# Altium schematic sheet MCU.SchDoc
size B
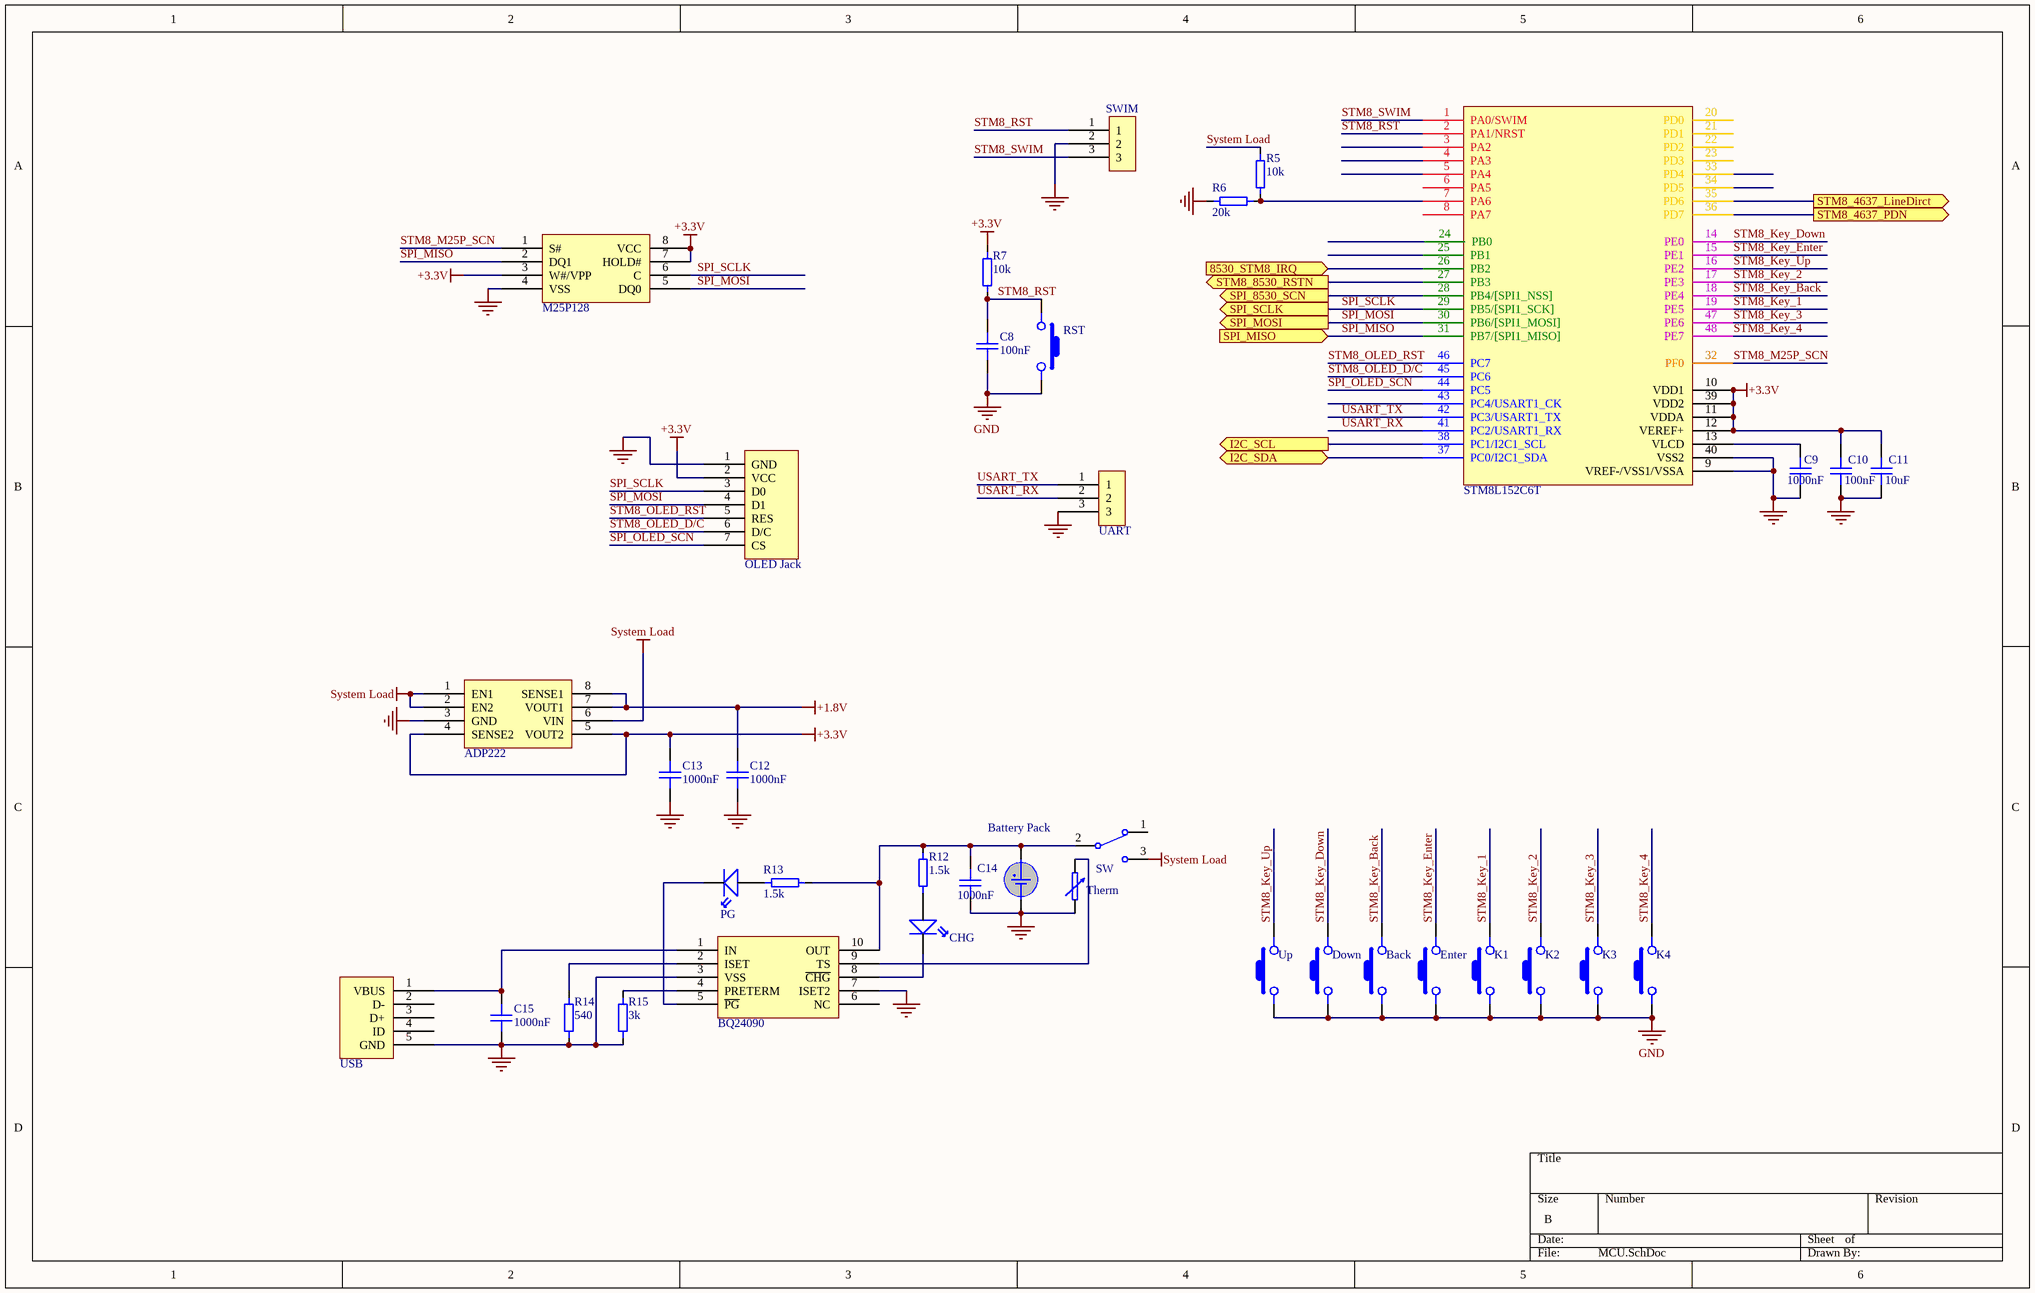
[diagram p0: MCU.SchDoc]

## Parts
ADP222  ADP222ACPZ-1833-R7  [ADP22x]  (value not drawn)
Back  Button  [Button_3x4]  (value not drawn)
Battery_Pack  Battery Pack  [Battery Jack small]  (value not drawn)
BQ24090  BQ24090  [BQ24090]  (value not drawn)
C8  value 100nF  [SMD 0402]  (hidden comment: Capacity SMD)
C9  value 1000nF  [SMD 0402]  (hidden comment: Capacity SMD)
C10  value 100nF  [SMD 0402]  (hidden comment: Capacity SMD)
C11  value 10uF  [SMD 0402]  (hidden comment: Capacity SMD)
C12  value 1000nF  [SMD 0402]  (hidden comment: Capacity SMD)
C13  value 1000nF  [SMD 0402]  (hidden comment: Capacity SMD)
C14  value 1000nF  [SMD 0402]  (hidden comment: Capacity SMD)
C15  value 1000nF  [SMD 0402_silk]  (hidden comment: Capacity SMD)
CHG  LED  [LED_0603]  (value not drawn)
Down  Button  [Button_3x4]  (value not drawn)
Enter  Button  [Button_3x4]  (value not drawn)
K1  Button  [Button_3x4]  (value not drawn)
K2  Button  [Button_3x4]  (value not drawn)
K3  Button  [Button_3x4]  (value not drawn)
K4  Button  [Button_3x4]  (value not drawn)
M25P128  M25P128  [M25P128]  (value not drawn)
OLED_Jack  OLED Jack  [OLED Jack]  (value not drawn)
PG  LED  [LED_0603]  (value not drawn)
R5  value 10k  [SMD 0402]  (hidden comment: Resistor SMD)
R6  value 20k  [SMD 0402]  (hidden comment: Resistor SMD)
R7  value 10k  [SMD 0402]  (hidden comment: Resistor SMD)
R12  value 1.5k  [SMD 0402]  (hidden comment: Resistor SMD)
R13  value 1.5k  [SMD 0402]  (hidden comment: Resistor SMD)
R14  value 540  [SMD 0402]  (hidden comment: Resistor SMD)
R15  value 3k  [SMD 0402]  (hidden comment: Resistor SMD)
RST  Button  [Button_3x4]  (value not drawn)
STM8L152C6T  STM8L152C6T  [STM LQFP48]  (value not drawn)
SW  Switch  [Switch 2P2T]  (value not drawn)
SWIM  Header_3x1  [HEADER_3x1_2.54]  (value not drawn)
Therm  Thermistor  [Header_2x1_2.00]  (value not drawn)
UART  Header_3x1  [HEADER_3x1_2.54]  (value not drawn)
Up  Button  [Button_3x4]  (value not drawn)
USB  USB Jack Mirco-B  [USB Micro-B]  (value not drawn)

## Ports
8530_STM8_IRQ (in), I2C_SCL (out), I2C_SDA (bidir), SPI_8530_SCN (out), SPI_MISO (in), SPI_MOSI (out), SPI_SCLK (out), STM8_4637_LineDirct (out), STM8_4637_PDN (out), STM8_8530_RSTN (out)

## Nets
+1.8V: ADP222.7(VOUT1) ADP222.8(SENSE1) C12.1
+3.3V: ADP222.4(SENSE2) ADP222.5(VOUT2) C10.2 C11.2 C13.2 M25P128.3(W#/VPP) M25P128.7(HOLD#) M25P128.8(VCC) OLED_Jack.2(VCC) R7.2 STM8L152C6T.10(VDD1) STM8L152C6T.11(VDDA) STM8L152C6T.12(VEREF+) STM8L152C6T.39(VDD2)
GND: ADP222.3(GND) Back.2 Battery_Pack.2 BQ24090.3(VSS) BQ24090.7(ISET2) C8.1 C9.1 C10.1 C11.1 C12.2 C13.1 C14.1 C15.1 Down.2 Enter.2 K1.2 K2.2 K3.2 K4.2 M25P128.4(VSS) OLED_Jack.1(GND) R6.1 R14.1 R15.1 RST.1 STM8L152C6T.9(VREF-/VSS1/VSSA) STM8L152C6T.40(VSS2) SWIM.2 Therm.2 UART.3 Up.2 USB.5(GND)
System Load: ADP222.1(EN1) ADP222.2(EN2) ADP222.6(VIN) R5.2 SW.3
8530_STM8_IRQ: STM8L152C6T.26(PB2) ; port 8530_STM8_IRQ
I2C_SCL: STM8L152C6T.38(PC1/I2C1_SCL) ; port I2C_SCL
I2C_SDA: STM8L152C6T.37(PC0/I2C1_SDA) ; port I2C_SDA
SPI_8530_SCN: STM8L152C6T.28(PB4/[SPI1_NSS]) ; port SPI_8530_SCN
SPI_MISO: M25P128.2(DQ1) STM8L152C6T.31(PB7/[SPI1_MISO]) ; port SPI_MISO
SPI_MOSI: M25P128.5(DQ0) OLED_Jack.4(D1) STM8L152C6T.30(PB6/[SPI1_MOSI]) ; port SPI_MOSI
SPI_OLED_SCN: OLED_Jack.7(CS) STM8L152C6T.44(PC5)
SPI_SCLK: M25P128.6(C) OLED_Jack.3(D0) STM8L152C6T.29(PB5/[SPI1_SCK]) ; port SPI_SCLK
STM8_4637_LineDirct: STM8L152C6T.35(PD6) ; port STM8_4637_LineDirct
STM8_4637_PDN: STM8L152C6T.36(PD7) ; port STM8_4637_PDN
STM8_8530_RSTN: STM8L152C6T.27(PB3) ; port STM8_8530_RSTN
STM8_Key_1: K1.1 STM8L152C6T.19(PE5)
STM8_Key_2: K2.1 STM8L152C6T.17(PE3)
STM8_Key_3: K3.1 STM8L152C6T.47(PE6)
STM8_Key_4: K4.1 STM8L152C6T.48(PE7)
STM8_Key_Back: Back.1 STM8L152C6T.18(PE4)
STM8_Key_Down: Down.1 STM8L152C6T.14(PE0)
STM8_Key_Enter: Enter.1 STM8L152C6T.15(PE1)
STM8_Key_Up: STM8L152C6T.16(PE2) Up.1
STM8_M25P_SCN: M25P128.1(S#) STM8L152C6T.32(PF0)
STM8_OLED_D/C: OLED_Jack.6(D/C) STM8L152C6T.45(PC6)
STM8_OLED_RST: OLED_Jack.5(RES) STM8L152C6T.46(PC7)
STM8_RST: C8.2 R7.1 RST.2 STM8L152C6T.2(PA1/NRST) SWIM.1
STM8_SWIM: STM8L152C6T.1(PA0/SWIM) SWIM.3
USART_RX: STM8L152C6T.41(PC2/USART1_RX) UART.2
USART_TX: STM8L152C6T.42(PC3/USART1_TX) UART.1
NetBattery_Pack_1: Battery_Pack.1 BQ24090.10(OUT) C14.2 R12.2 R13.2 SW.2
NetBQ24090_1: BQ24090.1(IN) C15.2 USB.1(VBUS)
NetBQ24090_2: BQ24090.2(ISET) R14.2
NetBQ24090_4: BQ24090.4(PRETERM) R15.2
NetBQ24090_5: BQ24090.5(~{PG}) PG.2
NetBQ24090_8: BQ24090.8(~{CHG}) CHG.2
NetBQ24090_9: BQ24090.9(TS) Therm.1
NetC9_2: C9.2 STM8L152C6T.13(VLCD)
NetCHG_1: CHG.1 R12.1
NetPG_1: PG.1 R13.1
NetR5_1: R5.1 R6.2 STM8L152C6T.7(PA6)

Not connected (* = marked no-connect by the designer): BQ24090 6(NC); STM8L152C6T 3(PA2) 4(PA3) 5(PA4) 6(PA5) 8(PA7) 20(PD0) 21(PD1) 22(PD2) 23(PD3) 24(PB0) 25(PB1) 33(PD4) 34(PD5) 43(PC4/USART1_CK); SW 1; USB 2(D-) 3(D+) 4(ID)

## Library data of the parts
ADP222 = ADP222: FootPrint: 8-Pin LFCSP
Therm = Thermistor NTC: Value: 10k; type: NTC
USB = USB Jack Micro-B
Battery_Pack = Battery Pack: FootPrint: 2.54mm
BQ24090 = BQ24090: FootPrint: 10-Pin MSOP
M25P128 = M25P128: FootPrint: VFDFPN8
OLED_Jack = OLED Jack: FootPrint: header 7x1 2.54mm
STM8L152C6T = STM8L152C6T: FootPrint: 48-Pin LQPF